# EAGLE design Grove Bee Socket V0.9a (EAGLE 6.3)
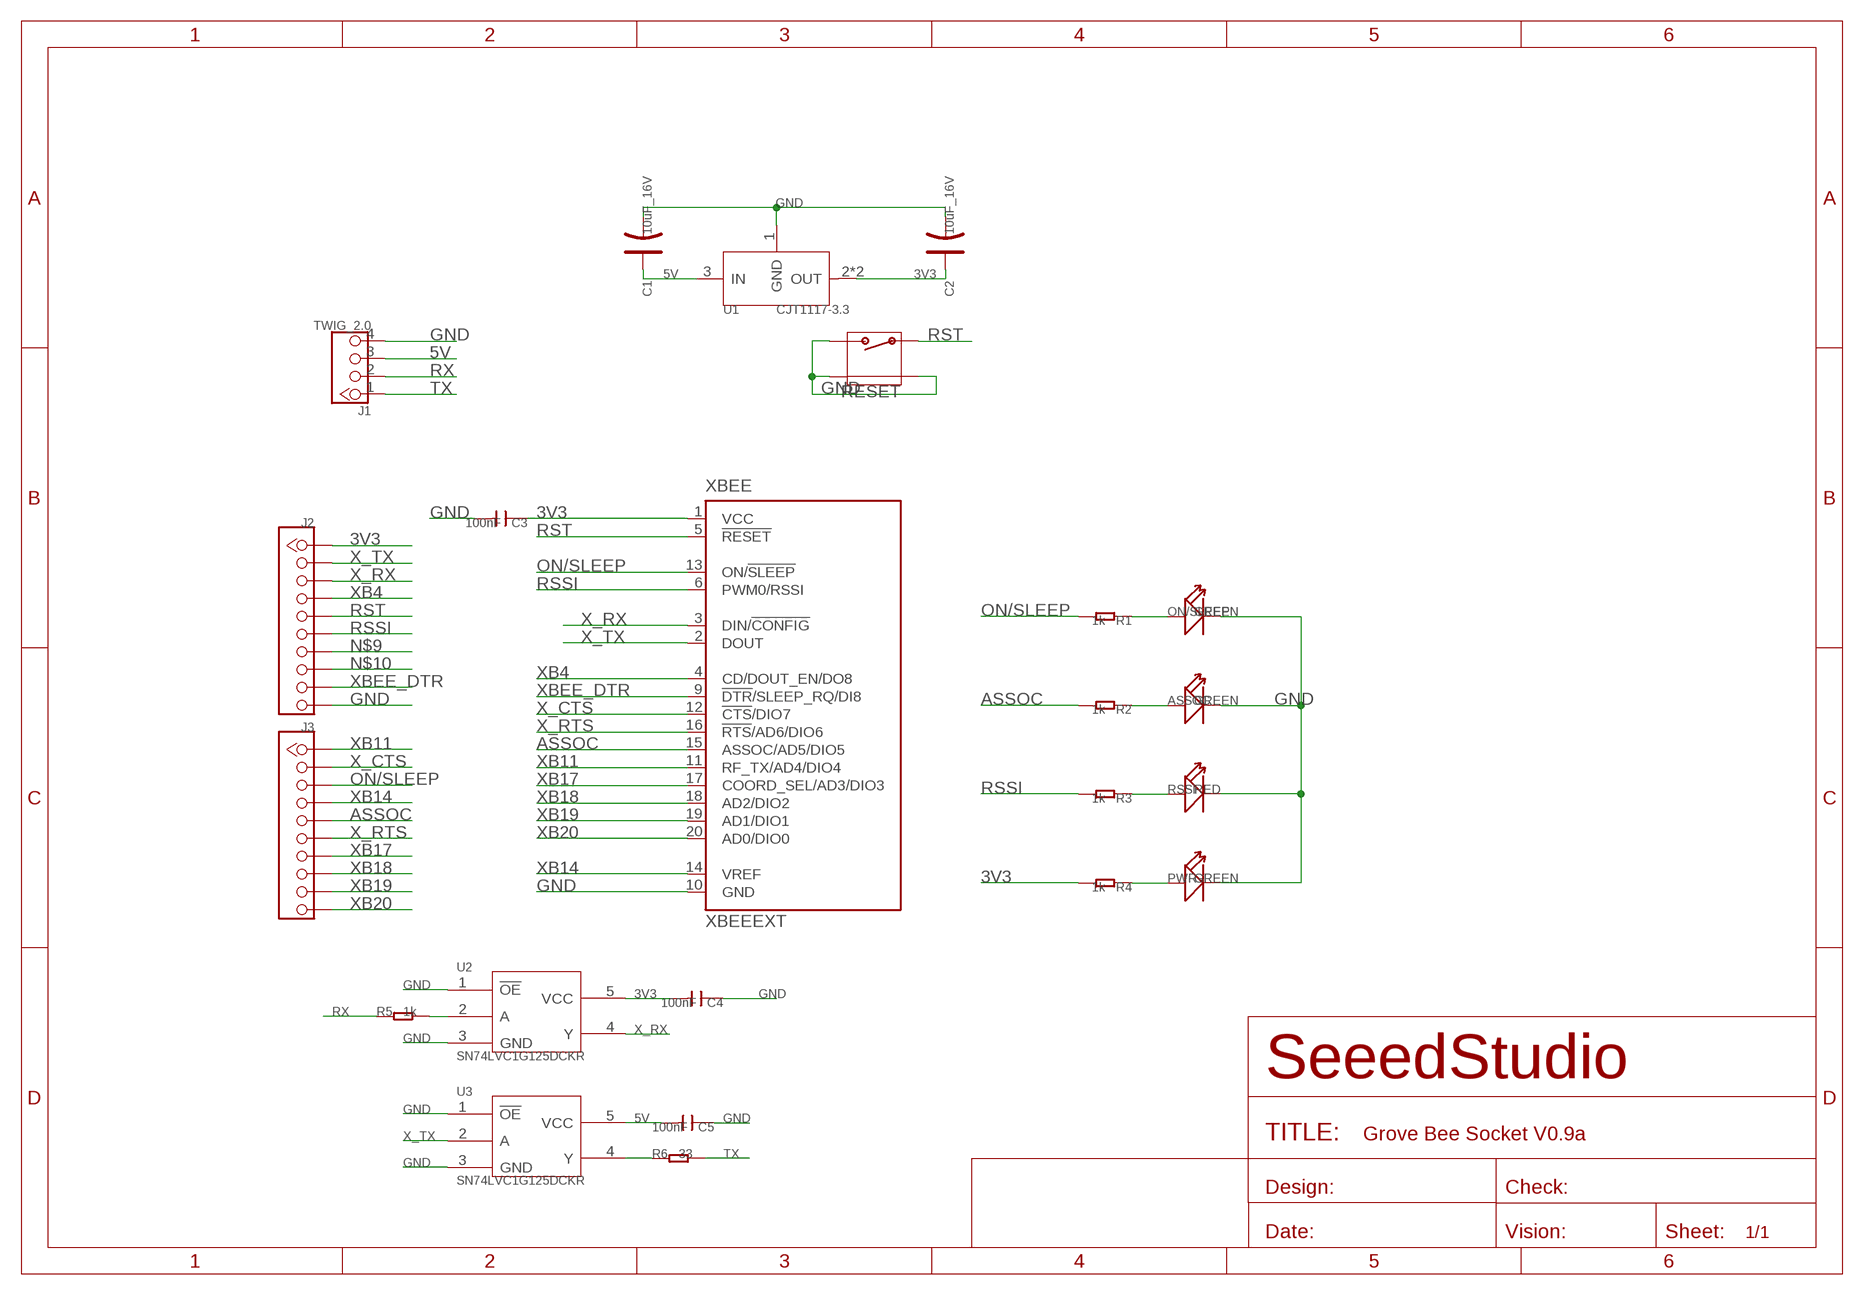
[diagram p0: schematic, sheet 1]

## Parts
ASSOC  GREEN  LED'0603'  [LED-0603]
C1  10uF_16V  CAP-AVX-A  [AVX-A]
C2  10uF_16V  CAP-AVX-A  [AVX-A]
C3  100nF  C-0603  [C0603]
C4  100nF  C-0603  [C0603]
C5  100nF  C-0603  [C0603]
J1  TWIG_2.0  [2.0_1X4]
J2  DNP  CK1X10DD  [CK1X10]
J3  DNP  CK1X10DD  [CK1X10]
ON/SLEEP  GREEN  LED'0603'  [LED-0603]
PWR  GREEN  LED'0603'  [LED-0603]
R1  1k  R-0603  [R0603]
R2  1k  R-0603  [R0603]
R3  1k  R-0603  [R0603]
R4  1k  R-0603  [R0603]
R5  1k  R-0603  [R0603]
R6  33  R-0603  [R0603]
RESET  FOR_TEST_ALBERT_V6_BUTTON_4P_SMD  [FOR_TEST_ALBERT_V6_4P-SMD-7X3.5X3.5]
RSSI  RED  LED'0603'  [LED-0603]
U1  CJT1117-3.3  LD1117S  [SOT-223]
U2  SN74LVC1G125DCKR  [SOT353]
U3  SN74LVC1G125DCKR  [SOT353]
XBEE  XBEEEXT  [XBEE_PLUG]

## Nets
3V3: C2.+ C3.1 C4.2 J2.1 R4.2 U1.2(OUT) U1.TER(OUT) U2.5(VCC) XBEE.1(VCC)
5V: C1.+ C5.2 J1.3 U1.3(IN) U3.5(VCC)
ASSOC: J3.5 R2.2 XBEE.15(ASSOC/AD5/DIO5)
GND: ASSOC.- C1.- C2.- C3.2 C4.1 C5.1 J1.4 J2.10 ON/SLEEP.- PWR.- RESET.2 RESET.S1 RESET.S2 RSSI.- U1.1(GND) U2.1(!OE!) U2.3(GND) U3.1(!OE!) U3.3(GND) XBEE.10(GND)
N$1: R6.1 U3.4(Y)
N$3: ON/SLEEP.+ R1.1
N$8: ASSOC.+ R2.1
N$9: J2.7
N$10: J2.8
N$11: R3.1 RSSI.+
N$14: PWR.+ R4.1
N$132: R5.2 U2.2(A)
ON/SLEEP: J3.3 R1.2 XBEE.13(ON/!SLEEP)
RSSI: J2.6 R3.2 XBEE.6(PWM0/RSSI)
RST: J2.5 RESET.1 XBEE.5(!RESET)
RX: J1.2 R5.1
TX: J1.1 R6.2
X_CTS: J3.2 XBEE.12(!CTS!/DIO7)
X_RTS: J3.6 XBEE.16(!RTS!/AD6/DIO6)
X_RX: J2.3 U2.4(Y) XBEE.3(DIN/!CONFIG)
X_TX: J2.2 U3.2(A) XBEE.2(DOUT)
XB4: J2.4 XBEE.4(CD/DOUT_EN/DO8)
XB11: J3.1 XBEE.11(RF_TX/AD4/DIO4)
XB14: J3.4 XBEE.14(VREF)
XB17: J3.7 XBEE.17(COORD_SEL/AD3/DIO3)
XB18: J3.8 XBEE.18(AD2/DIO2)
XB19: J3.9 XBEE.19(AD1/DIO1)
XB20: J3.10 XBEE.20(AD0/DIO0)
XBEE_DTR: J2.9 XBEE.9(!DTR!/SLEEP_RQ/DI8)

## Library data of the parts
ASSOC ON/SLEEP PWR RSSI = Discrete:LED*
C1 C2 = Discrete:CAP*: Electrolytic Capacitors,Tantalum Capacitors and Super Capacitors
C3-C5 = Discrete:C*: Ceramic Capacitors
J1 = CONNECTER:TWIG_2.0
J2 J3 = CONNECTER:CK1X10
R1-R6 = Discrete:R*
RESET = TFT_Touch:FOR_TEST_ALBERT_V6_BUTTON_4P_SMD: TS-1188E http://www.best-dz.com/?thread-374-2.html
U1 = IC:LD1117: Low Drop Fixed And Adjustable Positive Voltage Regulators http://www.datasheetcatalog.org/datasheet/SGSThomsonMicroelectronics/mXuqtqv.pdf
U2 U3 = Test:SN74LVC1G125DCKR: Signal bus buffer gate
XBEE = EXT_moudle:XBEE: XBee (TM) /XBee-PRO(TM) OEM RF Modules Source: MaxStream, Inc. xbee_productmanual.pdf

## Board
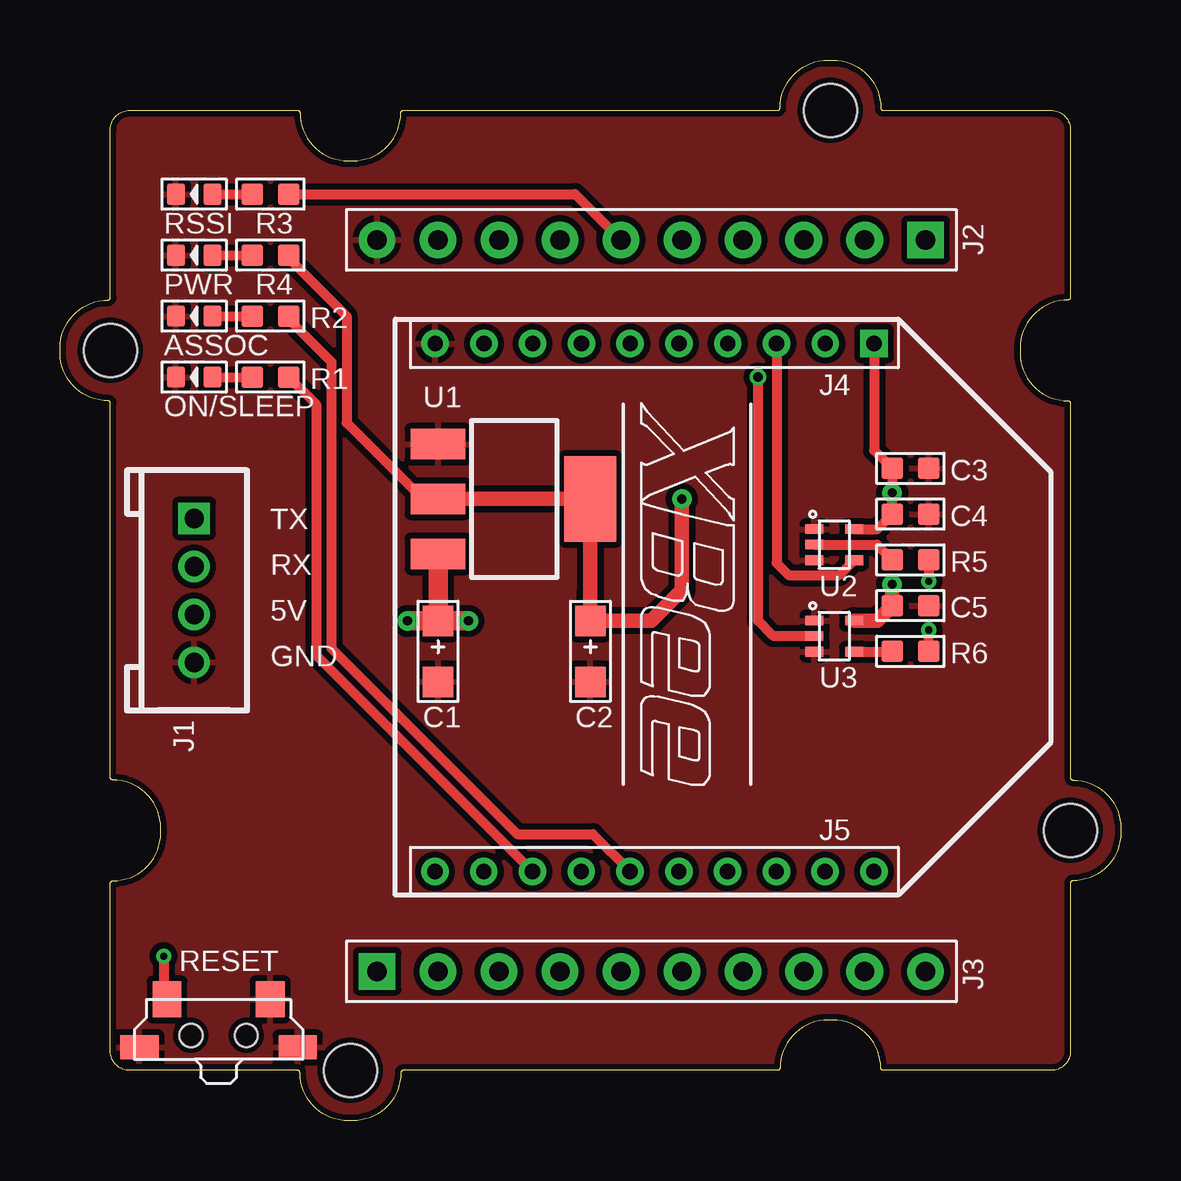
[diagram p1: board, top side]
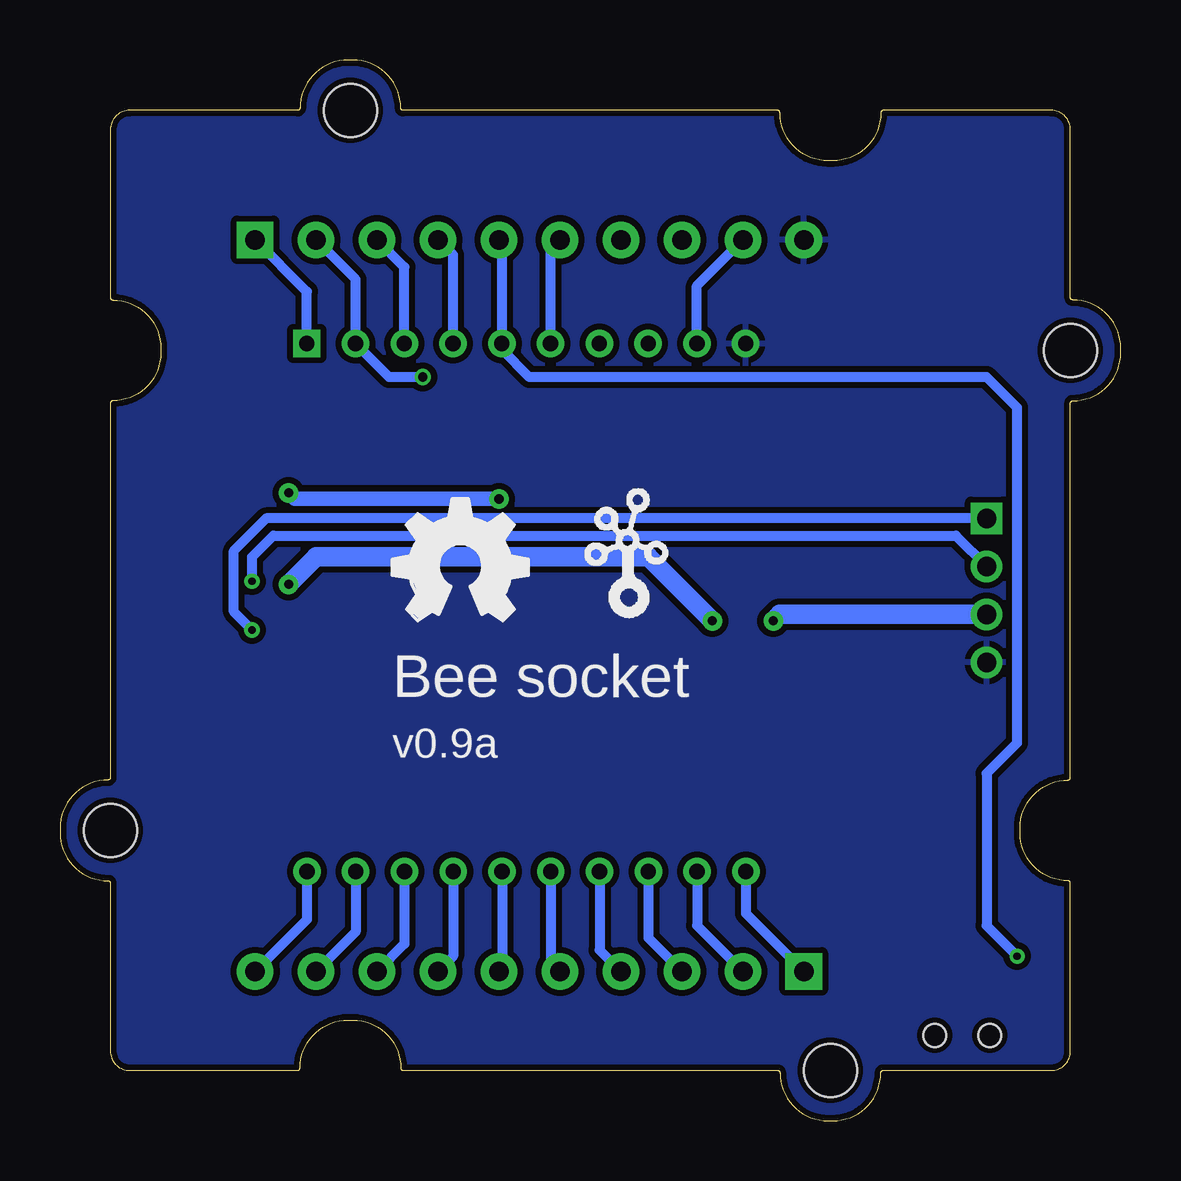
[diagram p2: board, bottom side, seen from below]

Size 44.2 x 44.2 mm. Coordinates in mm from the lower left corner, seen from the top.
Copper layers (1*16): Top 0.035mm / dielectric 1.5mm / Bottom 0.035mm
Design rules "SeeedStudio_rule_no_angle_090911 *": minimum track width 6mil, minimum drill 12mil, track to track 6mil, track to pad 6mil, pad to pad 6mil, via to via 6mil, smd to smd 0mil, copper to edge 10mil, drill to drill 10mil, minimum pad ring 10mil, minimum via ring 6mil, stop-mask expansion 2mil, vias tented up to drill 100mil, thermal gap 10mil

### Footprints (pad centres in the part's own frame; a part is rotated, then mirrored left to right if it is on the bottom)
LED-0603 = smd 0.762 x 0.889: + -0.762,0; - 0.762,0
AVX-A = smd 1.27 x 1.27: + -1.27,0; - 1.27,0
C0603 = smd 0.889 x 0.889: 1 -0.762,0; 2 0.762,0
2.0_1X4 = drill 0.8 pad 1.27 square: 1 -3,0 | drill 0.8 pad 1.27: 2 -1,0; 3 1,0; 4 3,0
CK1X10 = drill 0.813 pad 1.524 square: 1 0,11.43 | drill 0.813 pad 1.524: 2 0,8.89; 3 0,6.35; 4 0,3.81; 5 0,1.27; 6 0,-1.27; 7 0,-3.81; 8 0,-6.35; 9 0,-8.89; 10 0,-11.43
R0603 = smd 0.889 x 0.889: 1 -0.762,0; 2 0.762,0
FOR_TEST_ALBERT_V6_4P-SMD-7X3.5X3.5 = smd 1.2 x 1.5: 1 -2.15,1.5; 2 2.15,1.5 | smd 1.6 x 1: S1 -3.3,-0.5; S2 3.3,-0.5 | hole 0.95: -1.15,0; 1.15,0
SOT-223 = smd 1.27 x 2.286: 1 -2.286,-3.175; 2 0,-3.175; 3 2.286,-3.175 | smd 3.556 x 2.159: TER 0,3.175
SOT353 = smd 0.4 x 0.75: 1 -0.65,-0.825; 2 0,-0.825; 3 0.65,-0.825; 4 0.65,0.825; 5 -0.65,0.825
2X2U-DIM-W/-DRILL = hole 2.2: 10,20; -20,10; -10,-20; 20,-10
XBEE_PLUG = drill 0.635 pad 1.016 square: 1 0,0.008 | drill 0.635 pad 1.016: 2 0,-2.024; 3 0,-4.056; 4 0,-6.088; 5 0,-8.12; 6 0,-10.152; 7 0,-12.184; 8 0,-14.216; 9 0,-16.248; 10 0,-18.28; 11 21.996,-18.288; 12 21.996,-16.256; 13 21.996,-14.224; 14 21.996,-12.192; 15 21.996,-10.16; 16 21.996,-8.128; 17 21.996,-6.096; 18 21.996,-4.064; 19 21.996,-2.032; 20 21.996,0

### Placement (x,y rotation side)
ASSOC  5.59,33.53 180 top
C1  15.75,19.56 270 top
C2  22.1,19.56 270 top
C3  35.44,27.18 0 top
C4  35.44,25.28 180 top
C5  35.44,21.46 180 top
J1  5.59,22.1 270 top
J2  24.64,36.7 270 top
J3  24.64,6.23 90 top
ON/SLEEP  5.59,30.99 180 top
PWR  5.59,36.07 180 top
R1  8.77,30.99 0 top
R2  8.77,33.53 0 top
R3  8.77,38.61 0 top
R4  8.77,36.07 0 top
R5  35.44,23.37 180 top
R6  35.44,19.56 0 top
RESET  6.61,3.56 0 top
RSSI  5.59,38.61 180 top
U1  18.93,25.91 270 top
U2  32.26,24.01 270 top
U3  32.26,20.2 270 top
U$1  [OSHW_FILLX200_NOTEXT]  30.36,20.83 0 bottom
U$2  [2X2U-DIM-W/-DRILL]  22.1,22.1 0 top
U$3  [TWIGLOGO_SMALL]  22.74,20.83 0 bottom
XBEE  33.91,32.39 270 top

### Tracks (layer width: path | path; a pad name or v marks a point on that pad's centre or on a via)
3V3  (via drill 0.38 pad 0.81)
  Top 0.406: R4.2 9.53,35.94 11.94,33.53 11.94,29.09 15.12,25.91 U1.2 | U2.5 34.05,24.66 C4.2 v34.67,26.16 C3.1 33.92,27.93 XBEE.1
  Top 0.61: U1.2 U1.TER C2.+ | C2.+ 22.1,22.1 | v25.91,25.91 25.91,22.1 24.64,20.83 C2.+
  Bottom 0.406: XBEE.1 33.92,34.55 J2.1
  Bottom 0.61: v25.91,25.91 34.42,25.91 v34.67,26.16
5V  (via drill 0.38 pad 0.81)
  Top 0.61: U3.5 34.05,20.85 C5.2 v34.67,22.35
  Top 0.813: v14.48,20.83 C1.+ | U1.3 C1.+ | C1.+ v17.02,20.83
  Bottom 0.813: J1.3 14.21,21.1 v14.48,20.83 | v17.02,20.83 19.69,23.5 33.53,23.5 v34.67,22.35
ASSOC
  Top 0.406: R2.2 9.53,33.4 11.31,31.62 11.31,19.69 19.05,11.94 22.2,11.94 XBEE.15
  Bottom 0.406: XBEE.15 23.75,6.61 J3.5
GND
  pour Top (isolate 0.254): -0.12,-0.25 44.33,-0.25 44.33,5.97 44.33,44.45 -0.12,44.45 -0.12,29.59
  pour Bottom (isolate 0.254): -0.12,44.33 -0.12,-0.25 44.33,-0.25 44.33,44.45 7.62,44.45
N$1
  Top 0.406: U3.4 34.66,19.55 R6.1
N$3
  Top 0.406: ON/SLEEP.+ R1.1
N$8
  Top 0.406: ASSOC.+ R2.1
N$11
  Top 0.406: RSSI.+ R3.1
N$14
  Top 0.406: PWR.+ R4.1
N$132
  Top 0.406: U2.2 34.04,24.01 R5.2
ON/SLEEP
  Top 0.406: R1.2 10.67,29.85 10.67,19.41 XBEE.13
  Bottom 0.406: XBEE.13 19.69,7.62 J3.3
RSSI
  Top 0.406: R3.2 21.46,38.61 J2.6
  Bottom 0.406: XBEE.6 23.76,36.32 J2.6
RST  (via drill 0.3 pad 0.64)
  Top 0.406: v4.32,6.86 4.32,5.19 RESET.1
  Bottom 0.406: J2.5 25.79,36.59 XBEE.5 25.79,32.14 24.64,30.99 5.59,30.99 4.32,29.72 4.32,15.75 5.59,14.48 5.59,8.13 v4.32,6.86
RX  (via drill 0.3 pad 0.64)
  Top 0.406: R5.1 v36.2,22.48
  Bottom 0.406: v36.2,22.48 36.2,23.5 35.31,24.39 6.88,24.39 J1.2
TX  (via drill 0.3 pad 0.64)
  Top 0.406: R6.2 v36.2,20.45
  Bottom 0.406: v36.2,20.45 36.96,21.21 36.96,23.75 36.2,24.51 36.07,24.64 35.61,25.1 J1.1
X_CTS
  Bottom 0.406: XBEE.12 17.66,8.13 J3.2
X_RTS
  Bottom 0.406: XBEE.16 25.78,6.35 J3.6
X_RX
  Top 0.406: U2.4 32.68,22.95 32.47,22.74 30.36,22.74 29.86,23.24 XBEE.3
  Bottom 0.406: XBEE.3 29.86,35.57 J2.3
X_TX  (via drill 0.38 pad 0.41)
  Top 0.406: 30.36,20.2 U3.2 29.72,20.2 29.09,20.83 v29.09,30.99
  Bottom 0.406: J2.2 31.89,35.06 XBEE.2 30.49,30.99 v29.09,30.99
XB4
  Bottom 0.406: XBEE.4 27.82,36.08 J2.4
XB11
  Bottom 0.406: XBEE.11 15.62,8.64 J3.1
XB14
  Bottom 0.406: XBEE.14 21.72,7.11 J3.4
XB17
  Bottom 0.406: XBEE.17 27.82,6.86 J3.7
XB18
  Bottom 0.406: XBEE.18 29.85,7.37 J3.8
XB19
  Bottom 0.406: XBEE.19 31.88,7.88 J3.9
XB20
  Bottom 0.406: XBEE.20 33.91,8.38 J3.10
XBEE_DTR
  Bottom 0.406: XBEE.9 17.66,34.79 J2.9

### Text on the board
tPlace: J4 | TX | RX | 5V | GND | J5
bPlace: Bee socket | v0.9a